# EasyEDA Pro project 科协启蒙1.eprj

# Schematic Schematic1
Board Name: Board1; Create Date: 2025-02-17; Page Name: P1; Project Name: 科协启蒙1; Schematic Name: Schematic1; Update Date: 2025-02-18; Company: 嘉立创EDA; Page Size: A4; Version: V1.0
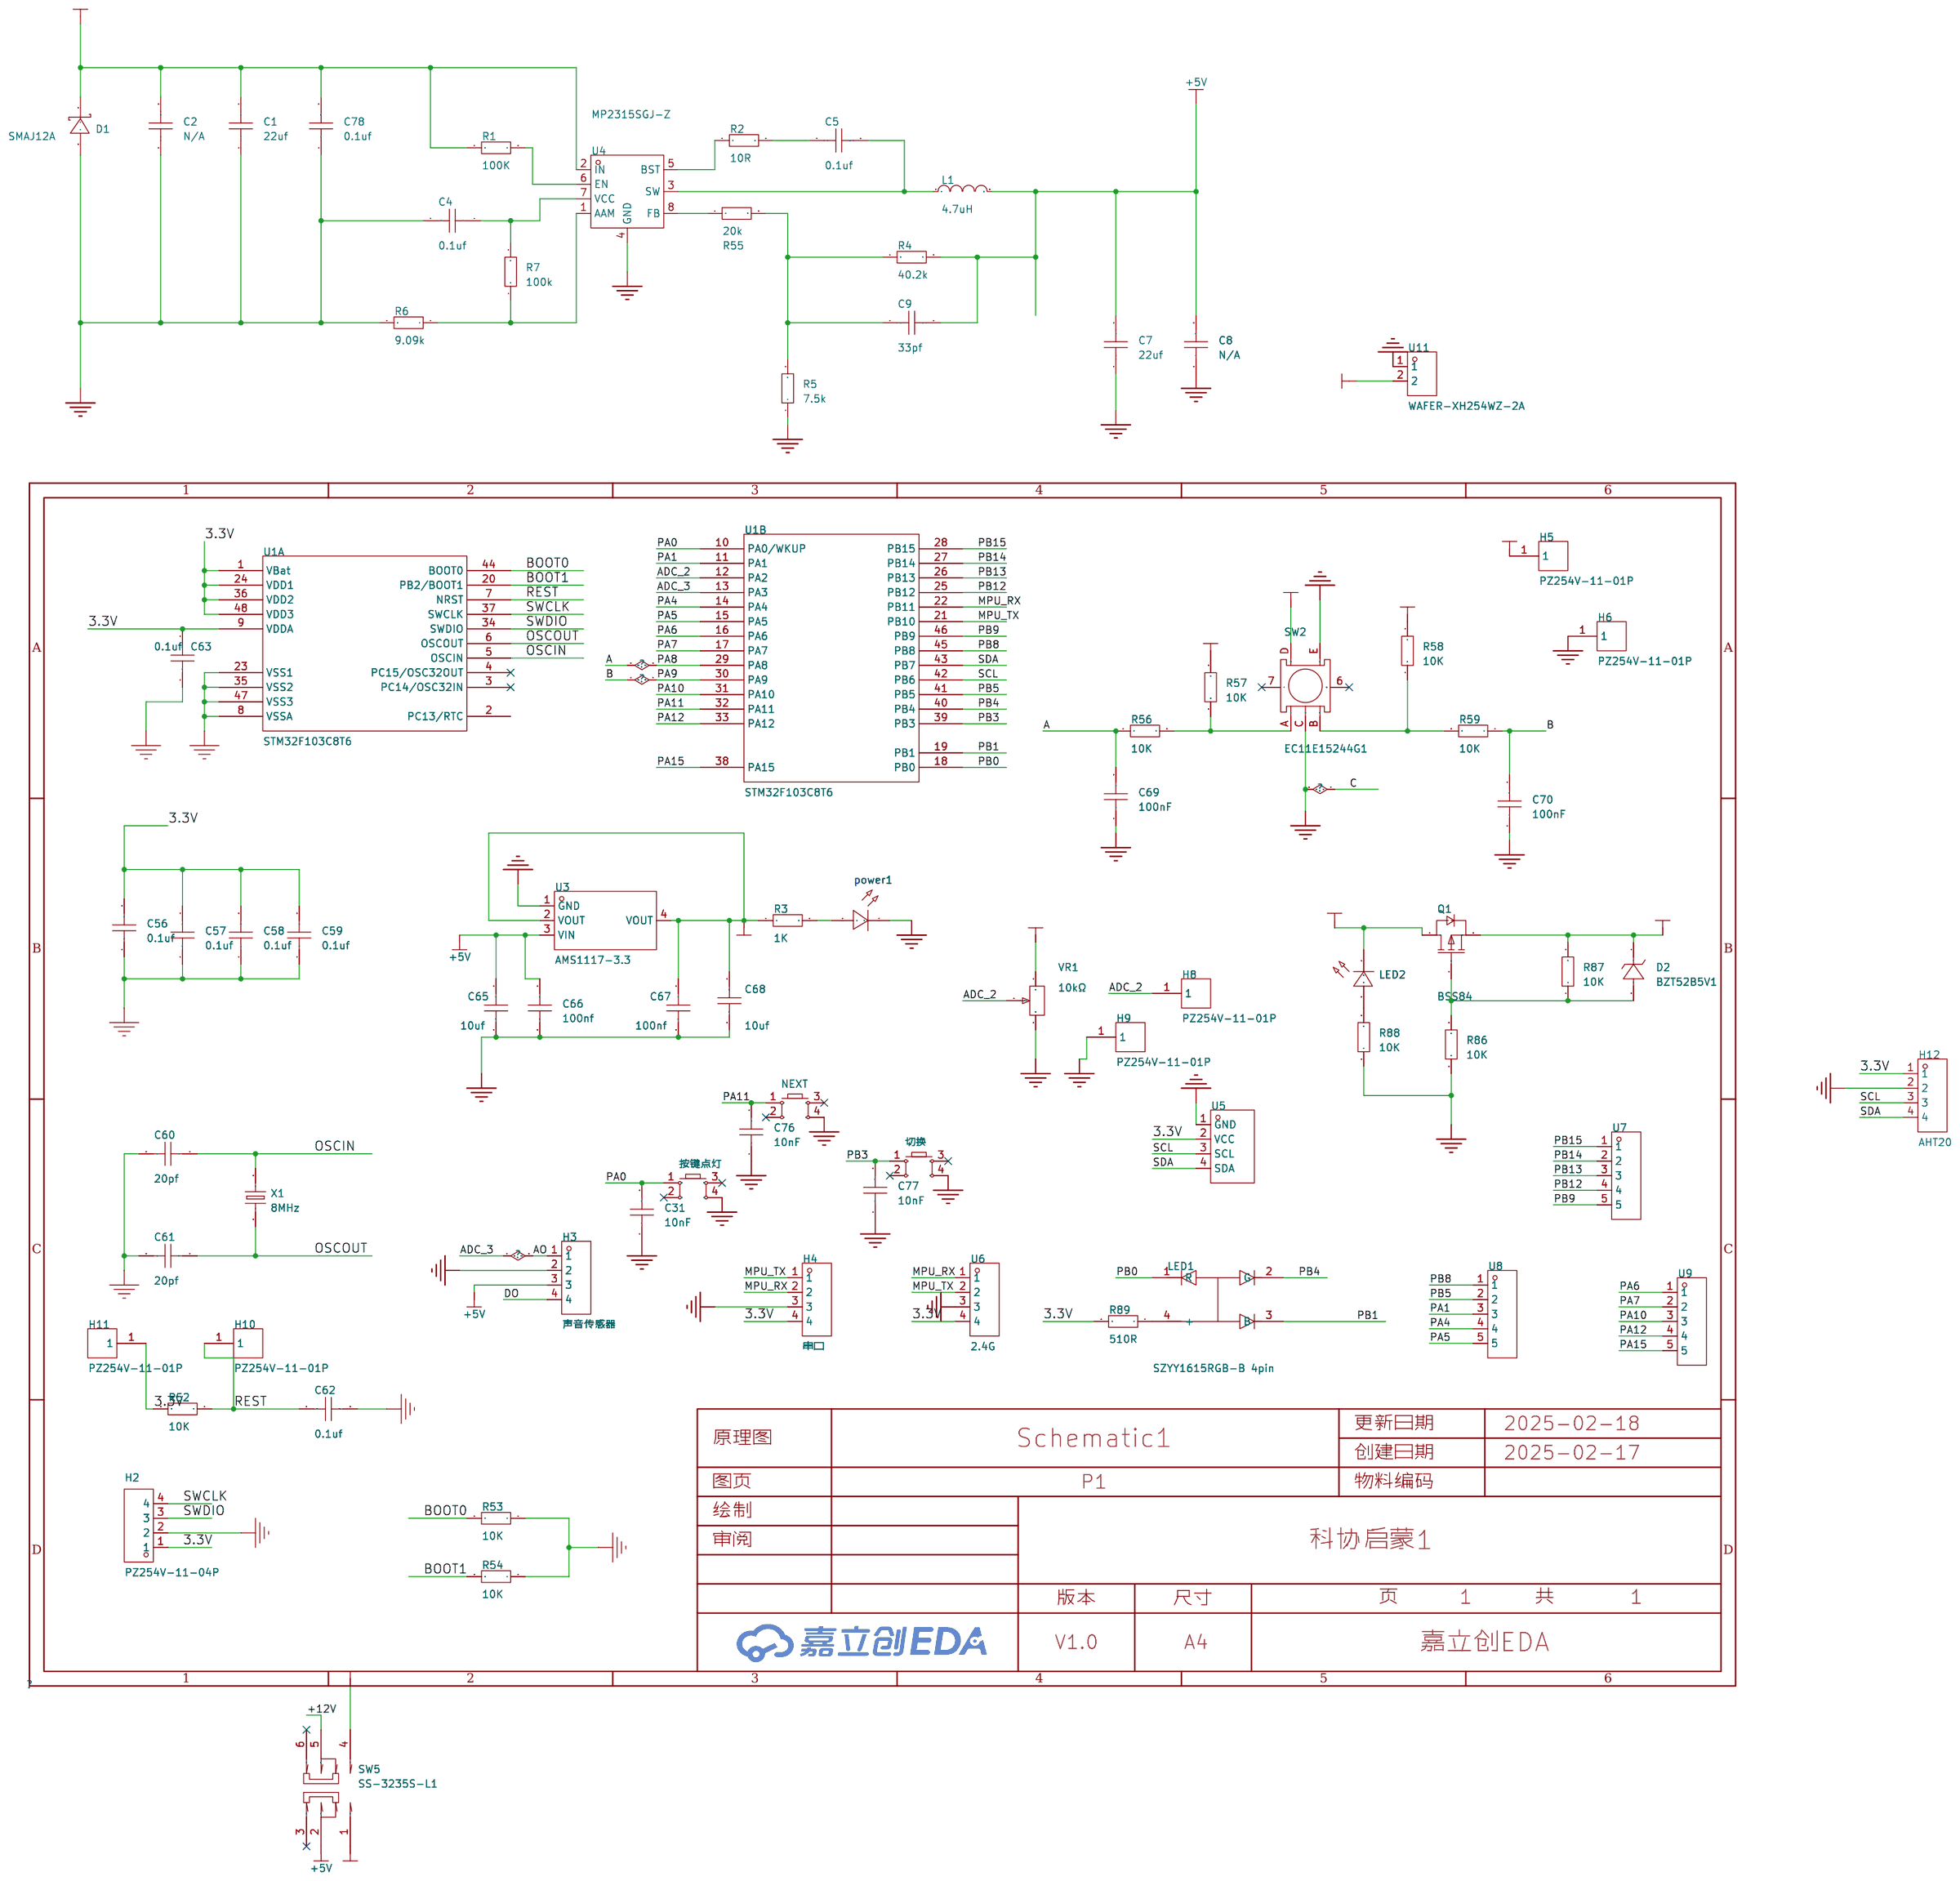
[diagram p0: schematic sheet]

## Parts
C1  22uf  [C1206]
C2  N/A  [C1206]
C4  0.1uf  [C0603]
C5  0.1uf  [C0603]
C7  22uf  [C0805]
C8  N/A  [C0805]
C9  33pf  [C0603]
C31  10nF  [C0603]
C56  0.1uf  [C0603]
C57  0.1uf  [C0603]
C58  0.1uf  [C0603]
C59  0.1uf  [C0603]
C60  20pf  [C0603]
C61  20pf  [C0603]
C62  0.1uf  [C0603]
C63  0.1uf  [C0603]
C65  10uf  [C0603]
C66  100nf  [C0603]
C67  100nf  [C0603]
C68  10uf  [C0603]
C69  100nF  [C0603]
C70  100nF  [C0603]
C76  10nF  [C0603]
C77  10nF  [C0603]
C78  0.1uf  [C0603]
D1  SMAJ12A  [SMA_L4.3-W2.8-LS5.1-RD]
D2  BZT52B5V1  [SOD-123_L2.7-W1.6-LS3.7-RD]
H2  PZ254V-11-04P  [HDR-TH_4P-P2.54-V-M]
H3  声音传感器  [HDR-TH_4P-P2.54-V-M]
H4  串口  [HDR-TH_4P-P2.54-V-M]
H5  PZ254V-11-01P  [HDR-TH_1P-P2.54-V-M]
H6  PZ254V-11-01P  [HDR-TH_1P-P2.54-V-M]
H8  PZ254V-11-01P  [HDR-TH_1P-P2.54-V-M]
H9  PZ254V-11-01P  [HDR-TH_1P-P2.54-V-M]
H10  PZ254V-11-01P  [HDR-TH_1P-P2.54-V-M]
H11  PZ254V-11-01P  [HDR-TH_1P-P2.54-V-M]
H12  AHT20  [HDR-TH_4P-P2.54-V-M]
L1  4.7uH  [IND-SMD_L7.8-W7.0_MAPM0630F]
LED1  SZYY1615RGB-B 4pin  [LED-SMD_4P-L1.6-W1.5-TR-1]
LED2  -  [LED_0805]
NEXT  -  [SW-SMD_4P-L6.0-W6.0-P4.50-LS9.0-2]
power1  -  [LED_0805]
Q1  BSS84  [SOT-23-3_L2.9-W1.3-P1.90-LS2.4-BR-1]
R1  100K  [R0805]
R2  10R  [R0805]
R3  1K  [R0805]
R4  40.2k  [R0805]
R5  7.5k  [R0805]
R6  9.09k  [R0805]
R7  100k  [R0805]
R52  10K  [R0805]
R53  10K  [R0805]
R54  10K  [R0805]
R55  20k  [R0805]
R56  10K  [R0805]
R57  10K  [R0805]
R58  10K  [R0805]
R59  10K  [R0805]
R86  10K  [R0805]
R87  10K  [R0805]
R88  10K  [R0805]
R89  510R  [R0805]
SW2  EC11E15244G1  [SW-TH_EC11E15244G1]
SW5  SS-3235S-L1  [SW-SMD_SS-3235S-LX]
U1  STM32F103C8T6  [LQFP48]  (sections 1,2)
U3  AMS1117-3.3  [SOT-223-3_L6.5-W3.4-P2.30-LS7.0-BR]
U4  MP2315SGJ-Z  [TSOT-23-8_L2.9-W1.6-P0.65-LS2.8-BL]
U5  HS96L03W2C03  [OLED-TH_L27.8-W27.2-P2.54_C9900033791]
U6  2.4G  [HDR-TH_4P-P2.00-V-M]
U7  MH254V-11-05-1196  [HDR-TH_5P-P2.54-V-M-1]
U8  MH254V-11-05-1196  [HDR-TH_5P-P2.54-V-M-1]
U9  MH254V-11-05-1196  [HDR-TH_5P-P2.54-V-M-1]
U11  WAFER-XH254WZ-2A  [CONN-TH_2P-P2.50_WAFER-XH254WZ-2A]
VR1  10kΩ  [RES-ADJ-TH_3362P]
X1  8MHz  [HC-49US_L11.5-W4.5-P4.88]
切换  -  [SW-SMD_4P-L6.0-W6.0-P4.50-LS9.0-2]
按键点灯  -  [SW-SMD_4P-L6.0-W6.0-P4.50-LS9.0-2]

## Library data of the parts
C1 C2 = CAP_1206: Supplier Footprint: 1206
C4 C5 C9 C31 C56-C63 C65-C70 C76-C78 = CAP_0603: Supplier Footprint: 0603
C7 C8 = CAP_0805: Supplier Footprint: 0805
D1 = SMAJ12A: 反向截止电压(Vrwm):12V;最大钳位电压:19.9V;峰值脉冲电流(Ipp)@10/1000us:20.1A;击穿电压:13.3V;; LCSC Part Name: 单向TVS 12V截止 20.1A峰值脉冲; Supplier Part: C356741; Manufacturer: JJW(捷捷微); Supplier Footprint: SMA(DO-214AC); JLCPCB Part Class: 扩展库; Datasheet: https://atta.szlcsc.com/upload/public/pdf/source/20190118/C364660_B64EB57815AD6306F3CC88F8ECD7A3CF.pdf; Supplier: LCSC; Reverse Stand-Off Voltage (Vrwm): 12V; Maximum Clamping Voltage: 19.9V; Peak Pulse Current (Ipp)@10/1000us: 20.1A; Breakdown Voltage: 13.3V; Type: TVS
D2 = BZT52B5V1_C19077393: Supplier Part: C19077393; Manufacturer: 宏嘉诚; Supplier Footprint: SOD-123; JLCPCB Part Class: 扩展库; Datasheet: https://atta.szlcsc.com/upload/public/pdf/source/20250106/AFD01FE5B0C707EDCEE558C585303F64.pdf; Supplier: LCSC; Diode Configuration: 独立式; Zener Voltage(Nom): 5.1V; Reverse Leakage Current (Ir): 2uA@2V; Zener Voltage(Range): 5V~5.2V; Pd - Power Dissipation(Pd): 500mW; Impedance(Zzt): 60Ω
H2-H4 H12 = PZ254V-11-04P: 插针结构:1x4P;间距:2.54mm;行距:-;圆针/方针:方针;安装类型:直插;排数:单排;总PIN位数:4P;额定电流:3A;额定电压:250V;配合针长度:6mm;塑高:2.5mm;端接针长度:3mm;触头材质:-;工作温度范围:-40℃~+105℃;颜色:黑色;; LCSC Part Name: 间距:2.54mm 1x4P 直插 方针; Supplier Part: C2691448; Manufacturer: XFCN(兴飞); Supplier Footprint: 插件,P=2.54mm; JLCPCB Part Class: 扩展库; Datasheet: https://atta.szlcsc.com/upload/public/pdf/source/20200309/C492403_F9F19131791D08044AD4F84F8E751A34.pdf; Supplier: LCSC; Pin Structure: 1x4P; Pitch: 2.54mm; Circluar Pins/Square Pins: 方针; Mounting Type: 直插; Number of Rows: 单排; Number of Pins: 4P; Current Rating (Max): 3A; Voltage Rating (Max): 250V; Length of Mating Pin: 6mm; Insulation Height: 2.5mm; Length of End Connection Pin: 3mm; Operating Temperature Range: -40℃~+105℃; Color: 黑色
H5 H6 H8-H11 = PZ254V-11-01P: LCSC Part Name: 间距:2.54mm 1x1P 直插 方针; Supplier Part: C492400; Manufacturer: XFCN(兴飞); Supplier Footprint: 插件,P=2.54mm; Datasheet: https://atta.szlcsc.com/upload/public/pdf/source/20200309/C492400_46876A5B545F5AE6B8D4A09C46E276E8.pdf; Supplier: LCSC; Pin Structure: 1x1P; Pitch: 2.54mm; Circluar Pins/Square Pins: 方针; Mounting Type: 直插; Number of Rows: 单排; Number of Pins: 1P; Length of Mating Pin: 6mm; Insulation Height: 2.5mm; Length of End Connection Pin: 3mm; Contact Material: 黄铜; Operating Temperature Range: -40℃~+105℃; Color: 黑色
L1 = JSHC0630H-4R7M-G: 电感值:4.7uH;精度:±20%;额定电流:5.5A;饱和电流(Isat):9A;; LCSC Part Name: 4.7uH ±20% 9A; Supplier Part: C334081; Manufacturer: JINLAI(金籁科技); Supplier Footprint: SMD,7.8x7mm; JLCPCB Part Class: 扩展库; Datasheet: https://atta.szlcsc.com/upload/public/pdf/source/20181121/C334111_5F82636A40C96DA87C2CFACA84BF944B.pdf; Supplier: LCSC; Tolerance: ±20%; Rated Current: 5.5A; Saturation Current (Isat): 9A; DC Resistance (DCR): 38mΩ
LED1 = SZYY1615RGB-B 4pin: Supplier Part: C3029071; Manufacturer: yongyu(永裕光电); Supplier Footprint: SMD-4P,1.6x1.5mm; JLCPCB Part Class: 扩展库; Datasheet: https://atta.szlcsc.com/upload/public/pdf/source/20220608/45D83B315EB4960EAA113BCE10CF8FC7.pdf; Supplier: LCSC
LED2 power1 = LED_0805-G: Supplier Footprint: 0805
NEXT 切换 按键点灯 = Key_SMD_6x6x6.5: Supplier Footprint: SMD
Q1 = BSS84_C7420340: LCSC Part Name: P沟道,电流:-0.17A,耐压:-60V; Supplier Part: C7420340; Manufacturer: 宏迦橙; Supplier Footprint: SOT-23; JLCPCB Part Class: 扩展库; Datasheet: https://atta.szlcsc.com/upload/public/pdf/source/20230630/CFCF3EFF80655E4500DCC7BD4B2736C9.pdf; Supplier: LCSC; Type: 1个P沟道; Drain Source Voltage (Vdss): 60V; Continuous Drain Current (Id): 170mA; Drain Source On Resistance (RDS(on)@Vgs,Id): 8Ω@10V,0.17A; Power Dissipation (Pd): 225mW; Gate Threshold Voltage (Vgs(th)@Id): 900mV@250uA; Total Gate Charge (Qg@Vgs): 1.77nC@10V; Input Capacitance (Ciss@Vds): 43pF; Reverse Transfer Capacitance (Crss@Vds): 2.8pF; Operating Temperature: -55℃~+150℃
R1 R2 R4-R7 R52-R59 R86-R89 = Res_0805: Supplier Footprint: 0805
R3 = 0805W8F1002T5E_C17414: 电阻类型:厚膜电阻;阻值:10kΩ;精度:±1%;功率:125mW;最大工作电压:150V;温度系数:±100ppm/℃;; LCSC Part Name: 10kΩ ±1% 125mW 厚膜电阻; Supplier Part: C17414; Manufacturer: UNI-ROYAL(厚声); Manufacturer Part: 0805W8F1002T5E; Supplier Footprint: 0805; JLCPCB Part Class: 基础库; Datasheet: https://atta.szlcsc.com/upload/public/pdf/source/20200306/C422600_1E6D84923E4A46A82E41ADD87F860B5C.pdf; Supplier: LCSC; Type: 厚膜电阻; Tolerance: ±1%; Power(Watts): 125mW; Overload Voltage (Max): 150V; Temperature Coefficient: ±100ppm/℃; Operating Temperature Range: -55℃~+155℃
SW2 = EC11E15244G1: LCSC Part Name: 编码器; Supplier Part: C370970; Manufacturer: ALPSALPINE(阿尔卑斯阿尔派); Supplier Footprint: 插件; JLCPCB Part Class: 扩展库; Datasheet: https://atta.szlcsc.com/upload/public/pdf/source/20190222/C370970_45D3DFC793E5CF6FACAF06DB9E7FAE9E.pdf; Supplier: LCSC
SW5 = SS-3235S-L1: 电路结构:双刀双掷;安装方式:卧贴;开关颜色:黑色;额定电流(DC):50mA;额定电压(DC):12V;额定电流(AC):50mA;额定电压(AC):12V;机械寿命:1万次;; LCSC Part Name: 柄长2mm 卧贴双档 滑动开关; Supplier Part: C500055; Manufacturer: XKB Connectivity(中国星坤); Supplier Footprint: SMD; JLCPCB Part Class: 扩展库; Datasheet: https://atta.szlcsc.com/upload/public/pdf/source/20211011/39D516E750C13BE9339464E723D9F132.pdf; Supplier: LCSC; Circuit: 双刀双掷; Actuator Style: 矩形柱状; Pin Style: 鸥翼型; Switch Length: 9.1mm; Switch Width: 3.55mm; Switch Height: 3.2mm; Mounting Style: 卧贴; Actuator Color: 黑色; Current Rating (DC): 50mA; Voltage Rating (DC): 12V; Current Rating (AC): 50mA; Voltage Rating (AC): 12V; Mechanical Life: 1万次; Operating Temperature: -40℃~+85℃
U1 = STM32F103C8T6: 物料名称: 单片机; 制造商: ST; 物料编码: TIC0036; 单位: PCS; Library Name: Yang_Lib
U3 = AMS1117-3.3_C6186: 输出类型:固定;最大输入电压:-;输出电压:3.3V;最大输出电流:1A;电源纹波抑制比(PSRR):72dB@(120Hz);输出极性:正极;; LCSC Part Name: 输出3.3V 1A; Supplier Part: C6186; Manufacturer: AMS; Supplier Footprint: SOT-223; JLCPCB Part Class: 基础库; Datasheet: https://atta.szlcsc.com/upload/public/pdf/source/20180727/C6186_7A095716F0823C02F1997A905E26C086.pdf; Supplier: LCSC; Output Type: 固定; Output Voltage: 3.3V; MAX Output Current: 1A; Power Supply Rejection Ratio (PSRR): 72dB@(120Hz); Dropout Voltage: 1.3V@(800mA); Output Polarity: 正极; Number of Outputs: 1
U4 = MP2315SGJ-Z: 功能类型:降压型;输出类型:可调;输入电压:4.5V~24V;输出电压:800mV~22.8V;输出电流:3A;; LCSC Part Name: 3A、24V、500kHz高效同步降压转换器; Supplier Part: C3031493; Manufacturer: MPS(芯源); Supplier Footprint: TSOT-23-8; JLCPCB Part Class: 扩展库; Supplier: LCSC; Function: 降压型; Output Type: 可调; Input Voltage: 4.5V~24V; Output Voltage: 800mV~22.8V; Output Current: 3A; Switching Frequency: 500kHz; Operating Temperature: -40℃~+125℃@(TJ); Synchronous Rectification: 是; Number of Outputs: 1; Topology: 降压式; Switch tube (built-in/external): 内置
U5 = HS96L03W2C03: LCSC Part Name: 0.96寸OLED显示屏窄白光IIC; Supplier Part: C5248080; Manufacturer: HS(汉昇); JLCPCB Part Class: 扩展库; Datasheet: https://atta.szlcsc.com/upload/public/pdf/source/20230627/763D01F79A90007632F098068C7C8AD9.pdf; Supplier: LCSC; Main Control Chip: SSD1315; Interface Type: I2C; Size: 0.96; Pixel Resolution: 128x64; Operating Temperature: -40℃~+70℃
U6 = PZ2.0-1*4: Supplier Part: C5224023; Manufacturer: ZHOURI(洲日); Supplier Footprint: 插件,P=2mm; JLCPCB Part Class: 扩展库; Datasheet: https://atta.szlcsc.com/upload/public/pdf/source/20221031/86DA6B3F99D5190A1F12189D7144ED5B.pdf; Supplier: LCSC; Pin Structure: 1x4P; Pitch: 2mm; Mounting Type: 直插; Number of Rows: 单排; Number of Pins: 4P; Contact Plating: 金
U7-U9 = MH254V-11-05-1196: Supplier Part: C3015084; Manufacturer: XFCN(兴飞); Supplier Footprint: 插件,P=2.54mm; JLCPCB Part Class: 扩展库; Datasheet: https://atta.szlcsc.com/upload/public/pdf/source/20220518/54992A1A2DF1C7E5202B51C2B9A2DABB.pdf; Supplier: LCSC
U11 = WAFER-XH254WZ-2A: Supplier Part: C7432691; Manufacturer: HANBO(汉博); Supplier Footprint: 插件,P=2.5mm; JLCPCB Part Class: 扩展库; Datasheet: https://atta.szlcsc.com/upload/public/pdf/source/20230721/127D646758C1D4B76FEF9901992220E1.pdf; Supplier: LCSC; Pins Structure: 1x2P; Pitch: 2.54mm; Mounting Style: 弯插; Reference Series: XH; Number of Pins: 2P; Number of Rows: 1; Number of PINs Per Row: 2; Current Rating (Max): 3A; Operating Temperature Range: -25℃~+85℃
VR1 = 3362P-1-103LF: LCSC Part Name: 10kΩ ±10%; Supplier Part: C58159; Manufacturer: BOURNS; Supplier Footprint: 插件-3P,7x6.6mm; JLCPCB Part Class: 扩展库; Datasheet: https://atta.szlcsc.com/upload/public/pdf/source/20160823/1471947545189.pdf; Supplier: LCSC; Tolerance: ±10%; Power(Watts): 500mW; Temperature Coefficient: ±100ppm/℃; Turns: 1
X1 = B08000J126: 晶振类型:直插晶振;频率:8MHz;常温频差:±10ppm;外接负载电容:20pF;频率稳定度(全温):±30ppm;; LCSC Part Name: 8MHz ±10ppm 20pF; Supplier Part: C280060; Manufacturer: ECEC(东晶); Supplier Footprint: HC-49S; JLCPCB Part Class: 扩展库; Datasheet: https://atta.szlcsc.com/upload/public/pdf/source/20190117/C280060_C26E861D869AE2E9E449CE809FA26154.pdf; Supplier: LCSC; Crystal Type: 直插晶振; Normal temperature Frequency Tolerance: ±10ppm; External load capacitor: 20pF; Frequency Stability(Full temperature range): ±30ppm; Equivalent Series Resistance (ESR): 40Ω; Operating Temperature: -40℃~+85℃

## Nets
3.3V: C56.2 C57.2 C58.2 C59.2 C63.2 C67.1 C68.1 H2.1 H4.4 H11.1 H12.1 R3.1 R52.2 R57.2 R58.2 R89.2 SW2.D U1.1(VBat) U1.9(VDDA) U1.24(VDD1) U1.36(VDD2) U1.48(VDD3) U3.2(VOUT) U3.4(VOUT) U5.2(VCC) U6.4 VR1.1
3.7V: SW5.1 U11.2
+5V: C7.2 C8.2 C9.2 C65.1 C66.1 H3.3 L1.2 R4.2 SW5.2 U3.3(VIN)
+12V: C1.2 C2.2 C78.2 D1.1(K) R1.1 SW5.5 U4.2(IN)
+12V_IN: D2.1(K) Q1.2(S) R87.2 SW5.4
GND: C1.1 C2.1 C4.2 C7.1 C8.1 C31.1 C56.1 C57.1 C58.1 C59.1 C60.2 C61.2 C62.1 C63.1 C65.2 C66.2 C67.2 C68.2 C69.1 C70.1 C76.1 C77.1 C78.1 D1.2(A) H2.2 H3.2 H4.3 H6.1 H9.1 H12.2 NEXT.4 power1.1(C) R5.1 R6.2 R53.1 R54.1 R86.1 R88.1 SW2.C SW2.E U1.8(VSSA) U1.23(VSS1) U1.35(VSS2) U1.47(VSS3) U3.1(GND) U4.4(GND) U5.1(GND) U6.3 U11.1 VR1.3 切换.4 按键点灯.4
A: C69.2 R56.1 U1.29(PA8)
ADC_2: H8.1 U1.12(PA2) VR1.2
ADC_3: H3.1 U1.13(PA3)
B: C70.2 R59.1 U1.30(PA9)
BAT+: H5.1 LED2.1(C) Q1.3(D)
BOOT0: R53.2 U1.44(BOOT0)
BOOT1: R54.2 U1.20(PB2/BOOT1)
DO: H3.4
MPU_RX: H4.2 U1.22(PB11) U6.1
MPU_TX: H4.1 U1.21(PB10) U6.2
OSCIN: C60.1 U1.5(OSCIN) X1.2
OSCOUT: C61.1 U1.6(OSCOUT) X1.1
PA0: C31.2 U1.10(PA0/WKUP) 按键点灯.1
PA1: U1.11(PA1) U8.3
PA4: U1.14(PA4) U8.4
PA5: U1.15(PA5) U8.5
PA6: U1.16(PA6) U9.1
PA7: U1.17(PA7) U9.2
PA10: U1.31(PA10) U9.3
PA11: C76.2 NEXT.1 U1.32(PA11)
PA12: U1.33(PA12) U9.4
PA15: U1.38(PA15) U9.5
PB0: LED1.1(R) U1.18(PB0)
PB1: LED1.3(B) U1.19(PB1)
PB3: C77.2 U1.39(PB3) 切换.1
PB4: LED1.2(G) U1.40(PB4)
PB5: U1.41(PB5) U8.2
PB8: U1.45(PB8) U8.1
PB9: U1.46(PB9) U7.5
PB12: U1.25(PB12) U7.4
PB13: U1.26(PB13) U7.3
PB14: U1.27(PB14) U7.2
PB15: U1.28(PB15) U7.1
REST: C62.2 H10.1 R52.1 U1.7(NRST)
SCL: H12.3 U1.42(PB6) U5.3(SCL)
SDA: H12.4 U1.43(PB7) U5.4(SDA)
SWCLK: H2.4 U1.37(SWCLK)
SWDIO: H2.3 U1.34(SWDIO)
$1N1144: power1.2(A) R3.2
$1N1772: R1.2 U4.6(EN)
$1N1773: C4.1 R7.2 U4.7(VCC)
$1N1775: C5.2 L1.1 U4.3(SW)
$1N1780: R2.1 U4.5(BST)
$1N1781: C5.1 R2.2
$1N1782: C9.1 R4.1 R5.2 R55.2
$1N1784: R55.1 U4.8(FB)
$1N1785: R6.1 R7.1 U4.1(AAM)
$1N2138: R56.2 R57.1 SW2.A
$1N2151: R58.1 R59.2 SW2.B
$1N4333: D2.2(A) Q1.1(G) R86.2 R87.1
$1N4541: LED2.2(A) R88.2
$1N6848: LED1.4(+) R89.1

Not connected (* = marked no-connect by the designer): NEXT 2* 3*; SW2 6* 7*; SW5 3* 6*; U1 2(PC13/RTC) 3(PC14/OSC32IN)* 4(PC15/OSC32OUT)*; 切换 2* 3*; 按键点灯 2* 3*

# Board PCB1
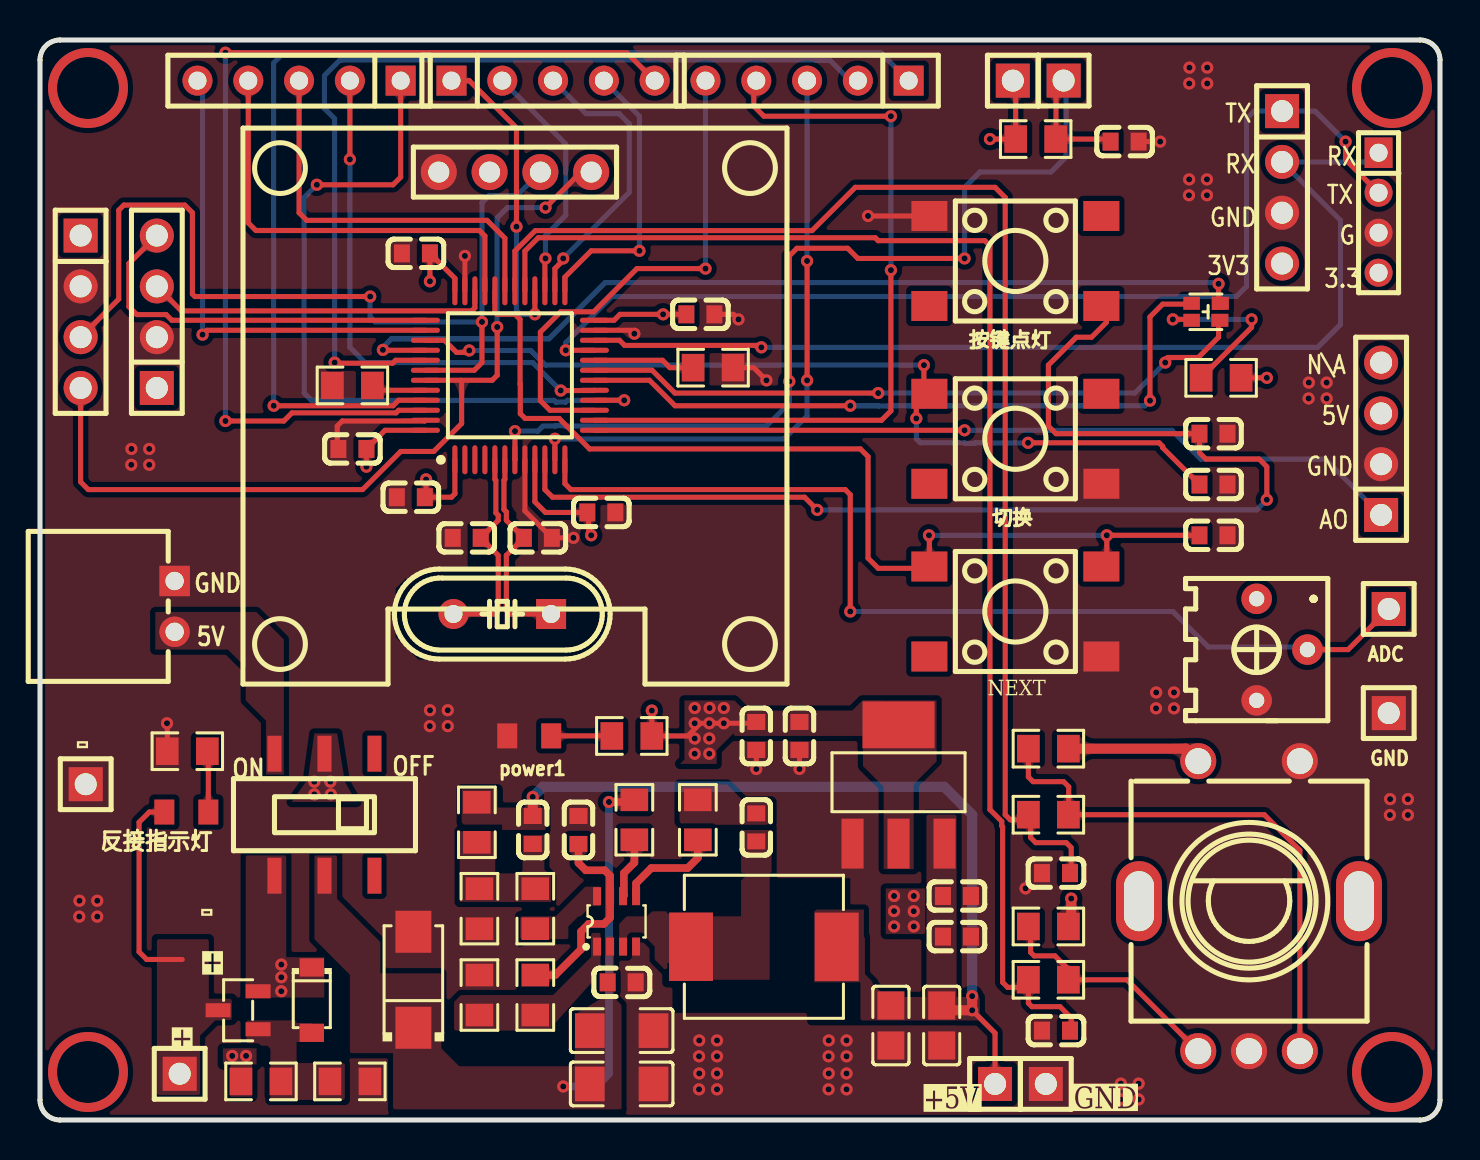
[diagram p1: board, top side]
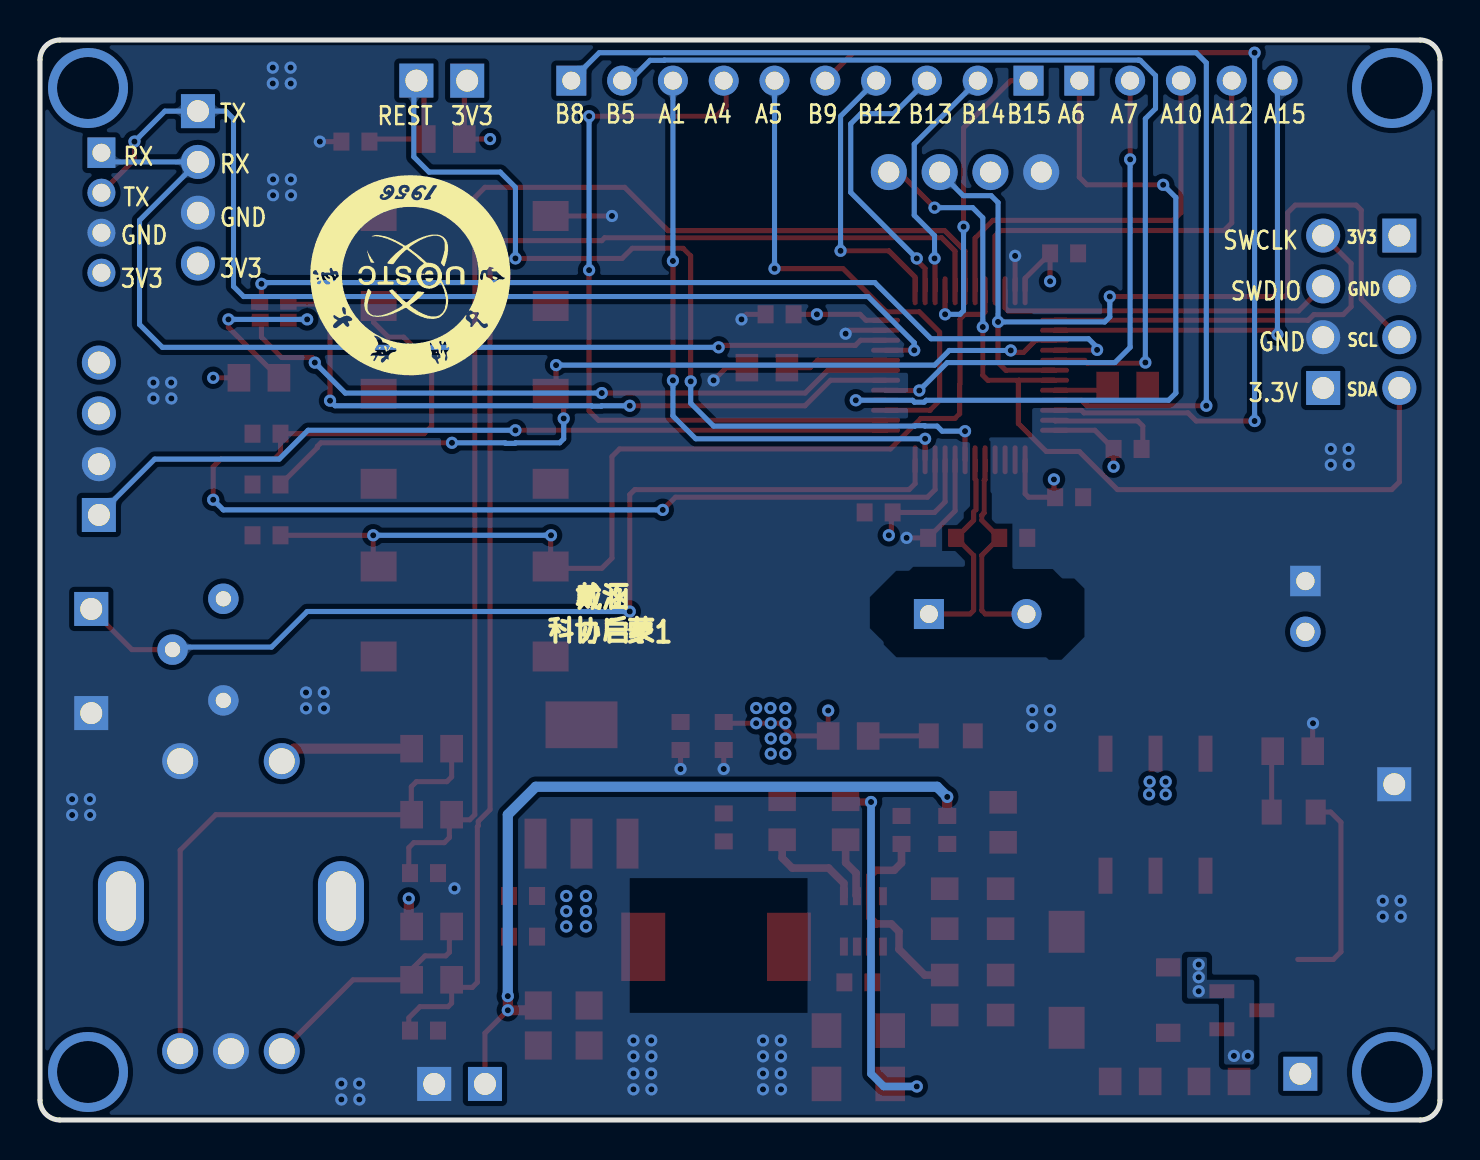
[diagram p2: board, bottom side, seen from below]

Outline 70 x 54 mm; copper layers: Top Layer, Inner1, Inner2, Bottom Layer. Coordinates in mm from the lower left corner of the outline.
Outline path: 0,53 0,1 arc(0.29,0.29) 1,0 69,0 arc(69.71,0.29) 70,1 70,53 arc(69.71,53.71) 69,54 1,54 arc(0.29,53.71) 0,53
Stack: Top Layer 0.035mm 外层铜厚1oz / Dielectric1 0.2104mm 7628 RC49% 8.6mil / Inner1 0.0152mm 内层铜厚 / Dielectric2 1.065mm 1.1mm H/HOZ Copper / Inner2 0.0152mm 内层铜厚 / Dielectric3 0.2104mm 7628 RC49% 8.6mil / Bottom Layer 0.035mm 外层铜厚1oz

## Design rules (mm)
net OSCIN: DP1
net OSCOUT: DP1
template: 自定义配置
spacing copperThickness1oz (default): track to track 0.102, other pairs 0.152 to 0.3
spacing copperThickness2oz: track to track 0.203, other pairs 0.152 to 0.3
track width copperThickness1oz (default): min 0.127, default 0.254, max 2.54
track width copperThickness2oz: min 0.203, default 0.254, max 2.54
differential pair differentialPair (default): width min 0.127, default 0.254, max 2.54; gap min 0.152, default 0.152
via viaSize (default): diameter min 0.5, default 0.61, max 10; hole min 0.3, default 0.305, max 6.3
net +12V uses copperRegion1
net GND uses copperRegion1
net $1N1775 uses copperRegion1
net $1N1781 uses copperRegion1
net +5V uses copperRegion1
net 3.3V uses copperRegion1
net $1N1785 uses copperRegion1
net $1N1784 uses copperRegion1
net $1N4333 uses copperRegion1
net +12V_IN uses copperRegion1
net BAT+ uses copperRegion1

## Placement (name value [footprint] x y rotation side)
ADC  PZ254V-11-01P  [HDR-TH_1P-P2.54-V-M]  67.44 25.55 0 top
C1  22uf  [C1206]  29.08 4.47 180 top
C2  N/A  [C1206]  29.08 1.8 180 top
C4  0.1uf  [C0603]  26.92 14.5 90 top
C5  0.1uf  [C0603]  35.81 14.63 270 top
C7  22uf  [C0805]  45.09 4.72 90 top
C8  N/A  [C0805]  42.54 4.72 90 top
C9  33pf  [C0603]  24.64 14.5 90 top
C31  10nF  [C0603]  58.67 34.31 180 top
C56  0.1uf  [C0603]  33.02 40.28 180 top
C57  0.1uf  [C0603]  18.8 43.33 0 top
C58  0.1uf  [C0603]  18.54 31.14 0 top
C59  0.1uf  [C0603]  28.07 30.38 180 top
C60  20pf  [C0603]  21.34 29.11 180 top
C61  20pf  [C0603]  24.89 29.11 0 top
C62  0.1uf  [C0603]  54.23 48.92 180 top
C63  0.1uf  [C0603]  15.62 33.55 0 top
C65  10uf  [C0603]  45.85 9.17 0 top
C66  100nf  [C0603]  45.85 11.2 0 top
C67  100nf  [C0603]  37.97 19.2 270 top
C68  10uf  [C0603]  35.81 19.2 270 top
C69  100nF  [C0603]  50.8 4.47 0 top
C70  100nF  [C0603]  50.8 12.34 0 top
C76  10nF  [C0603]  58.67 29.23 180 top
C77  10nF  [C0603]  58.67 31.78 180 top
C78  0.1uf  [C0603]  29.08 6.88 180 top
D1  SMAJ12A  [SMA_L4.3-W2.8-LS5.1-RD]  18.67 7.01 90 top
D2  BZT52B5V1  [SOD-123_L2.7-W1.6-LS3.7-RD]  13.59 5.99 270 top
GND  PZ254V-11-01P  [HDR-TH_1P-P2.54-V-M]  67.44 20.34 0 top
H2  PZ254V-11-04P  [HDR-TH_4P-P2.54-V-M]  5.84 40.41 90 top
H3  声音传感器  [HDR-TH_4P-P2.54-V-M]  67.06 34.06 90 top
H4  串口  [HDR-TH_4P-P2.54-V-M]  62.1 46.63 270 top
H5  PZ254V-11-01P  [HDR-TH_1P-P2.54-V-M]  6.98 2.31 0 top
H6  PZ254V-11-01P  [HDR-TH_1P-P2.54-V-M]  2.29 16.79 0 top
H6#2  -  [HDR-TH_1P-P2.54-V-M]  47.75 1.8 0 top
H6#3  -  [HDR-TH_1P-P2.54-V-M]  50.29 1.8 0 top
H10  PZ254V-11-01P  [HDR-TH_1P-P2.54-V-M]  51.18 51.97 0 top
H11  PZ254V-11-01P  [HDR-TH_1P-P2.54-V-M]  48.64 51.97 0 top
H12  AHT20  [HDR-TH_4P-P2.54-V-M]  2.03 40.41 270 top
L1  4.7uH  [IND-SMD_L7.8-W7.0_MAPM0630F]  36.19 8.66 180 top
LED1  SZYY1615RGB-B 4pin  [LED-SMD_4P-L1.6-W1.5-TR-1]  58.29 40.41 90 top
LED2  -  [LED_0805]  7.37 15.39 0 top
NEXT  -  [SW-SMD_4P-L6.0-W6.0-P4.50-LS9.0-2]  48.77 25.42 0 top
power1  -  [LED_0805]  24.51 19.2 0 top
Q1  BSS84  [SOT-23-3_L2.9-W1.3-P1.90-LS2.4-BR-1]  9.91 5.49 0 top
R1  100K  [R0805]  29.72 15.01 270 top
R2  10R  [R0805]  32.89 15.01 90 top
R3  1K  [R0805]  29.59 19.2 180 top
R4  40.2k  [R0805]  21.84 14.88 90 top
R5  7.5k  [R0805]  21.97 10.57 90 top
R6  9.09k  [R0805]  21.97 6.25 90 top
R7  100k  [R0805]  24.76 6.25 90 top
R52  10K  [R0805]  49.78 49.05 180 top
R53  10K  [R0805]  15.62 36.73 0 top
R54  10K  [R0805]  33.66 37.62 180 top
R55  20k  [R0805]  24.76 10.57 90 top
R56  10K  [R0805]  50.42 7.01 0 top
R57  10K  [R0805]  50.42 9.68 0 top
R58  10K  [R0805]  50.42 18.57 0 top
R59  10K  [R0805]  50.42 15.27 0 top
R86  10K  [R0805]  15.49 1.93 180 top
R87  10K  [R0805]  11.05 1.93 180 top
R88  10K  [R0805]  7.37 18.44 0 top
R89  510R  [R0805]  59.06 37.11 0 top
SW2  EC11E15244G1  [SW-TH_EC11E15244G1]  60.45 10.69 0 top
SW5  SS-3235S-L1  [SW-SMD_SS-3235S-LX]  14.22 15.27 0 top
U1  STM32F103C8T6  [LQFP48]  23.5 37.24 90 top
U3  AMS1117-3.3  [SOT-223-3_L6.5-W3.4-P2.30-LS7.0-BR]  42.93 16.79 270 top
U4  MP2315SGJ-Z  [TSOT-23-8_L2.9-W1.6-P0.65-LS2.8-BL]  28.83 9.93 0 top
U5  HS96L03W2C03  [OLED-TH_L27.8-W27.2-P2.54_C9900033791]  23.75 47.4 0 top
U6  2.4G  [HDR-TH_4P-P2.00-V-M]  66.93 45.36 270 top
U7  MH254V-11-05-1196  [HDR-TH_5P-P2.54-V-M-1]  25.65 51.97 0 top
U8  MH254V-11-05-1196  [HDR-TH_5P-P2.54-V-M-1]  38.35 51.97 180 top
U9  MH254V-11-05-1196  [HDR-TH_5P-P2.54-V-M-1]  12.95 51.97 180 top
U11  WAFER-XH254WZ-2A  [CONN-TH_2P-P2.50_WAFER-XH254WZ-2A]  6.73 25.68 270 top
VR1  10kΩ  [RES-ADJ-TH_3362P]  62.1 23.52 270 top
X1  8MHz  [HC-49US_L11.5-W4.5-P4.88]  23.11 25.3 180 top
切换  -  [SW-SMD_4P-L6.0-W6.0-P4.50-LS9.0-2]  48.77 34.06 0 top
按键点灯  -  [SW-SMD_4P-L6.0-W6.0-P4.50-LS9.0-2]  48.77 42.95 180 top

## Footprints (pads in the part's own frame, mm; a bottom-side part is the same pattern mirrored in y, then rotated)
C0603
  rect 0.8x0.9 smd: 1(-0.7,0) 2(0.7,0)
C0805
  rect 1.41x1.35 smd: 1(-1,0) 2(1,0)
C1206
  rect 1.485x1.728 smd: 1(-1.593,0) 2(1.593,0)
CONN-TH_2P-P2.50_WAFER-XH254WZ-2A
  rect 1.524x1.524 hole 0.914: 1(-1.27,0)
  round 1.524 hole 0.914: 2(1.27,0)
HC-49US_L11.5-W4.5-P4.88
  rect 1.5x1.5 hole 0.9: 1(-2.44,0)
  round 1.5 hole 0.9: 2(2.44,0)
HDR-TH_1P-P2.54-V-M
  rect 1.7x1.7 hole 1.1: 1(0,0)
HDR-TH_4P-P2.00-V-M
  rect 1.524x1.4 hole 0.9: 1(-3,0)
  round 1.4 hole 0.9: 2(-1,0) 3(1,0) 4(3,0)
HDR-TH_4P-P2.54-V-M
  rect 1.7x1.7 hole 1.1: 1(-3.81,0)
  round 1.7 hole 1.1: 2(-1.27,0) 3(1.27,0) 4(3.81,0)
HDR-TH_5P-P2.54-V-M-1
  rect 1.5x1.5 hole 0.9: 1(-5.08,0)
  round 1.5 hole 0.9: 2(-2.54,0) 3(0,0) 4(2.54,0) 5(5.08,0)
IND-SMD_L7.8-W7.0_MAPM0630F
  rect 2.194x3.42 smd: 1(3.643,0) 2(-3.643,0)
LED-SMD_4P-L1.6-W1.5-TR-1
  custom 0.65x0.825 smd: 1(0.425,0.713) 4(-0.425,0.713)
  rect 0.65x0.65 smd: 2(0.425,-0.625)
  custom 0.65x0.85 smd: 2(0.425,-0.725)
  custom 0.65x0.851 smd: 3(-0.425,-0.7)
LED_0805
  rect 1x1.25 smd: 1(-1.15,0.005) 2(1.05,0.005)
LQFP48
  oval 1.45x0.254 smd: 1(-4.225,2.75) 2(-4.225,2.25) 3(-4.225,1.75) 4(-4.225,1.25) 5(-4.225,0.75) 6(-4.225,0.25) 7(-4.225,-0.25) 8(-4.225,-0.75) 9(-4.225,-1.25) 10(-4.225,-1.75) 11(-4.225,-2.25) 12(-4.225,-2.75) 25(4.225,-2.75) 26(4.225,-2.25) 27(4.225,-1.75) 28(4.225,-1.25) 29(4.225,-0.75) 30(4.225,-0.25) 31(4.225,0.25) 32(4.225,0.75) 33(4.225,1.25) 34(4.225,1.75) 35(4.225,2.25) 36(4.225,2.75)
  oval 0.254x1.45 smd: 13(-2.75,-4.225) 14(-2.25,-4.225) 15(-1.75,-4.225) 16(-1.25,-4.225) 17(-0.75,-4.225) 18(-0.25,-4.225) 19(0.25,-4.225) 20(0.75,-4.225) 21(1.25,-4.225) 22(1.75,-4.225) 23(2.25,-4.225) 24(2.75,-4.225) 37(2.75,4.225) 38(2.25,4.225) 39(1.75,4.225) 40(1.25,4.225) 41(0.75,4.225) 42(0.25,4.225) 43(-0.25,4.225) 44(-0.75,4.225) 45(-1.25,4.225) 46(-1.75,4.225) 47(-2.25,4.225) 48(-2.75,4.225)
OLED-TH_L27.8-W27.2-P2.54_C9900033791
  round 1.8 hole 1.05: 1(-3.81,0) 2(-1.27,0) 3(1.27,0) 4(3.81,0)
R0805
  rect 1.133x1.377 smd: 1(-1,0) 2(1,0)
RES-ADJ-TH_3362P
  round 1.524 hole 0.762: 1(-2.54,-1.27) 2(0,1.27) 3(2.54,-1.27)
SMA_L4.3-W2.8-LS5.1-RD
  rect 2.1x1.8 smd: 1(-2.4,0) 2(2.4,0)
SOD-123_L2.7-W1.6-LS3.7-RD
  rect 0.91x1.22 smd: 1(-1.635,0) 2(1.635,0)
SOT-23-3_L2.9-W1.3-P1.90-LS2.4-BR-1
  rect 1.25x0.7 smd: 1(1,-0.95) 2(1,0.95) 3(-1,0)
SOT-223-3_L6.5-W3.4-P2.30-LS7.0-BR
  rect 2.5x1.1 smd: 1(2.97,-2.3) 2(2.97,0) 3(2.97,2.3)
  rect 2.34x3.6 smd: 4(-2.97,0)
SW-SMD_4P-L6.0-W6.0-P4.50-LS9.0-2
  rect 1.8x1.5 smd: 1(-4.3,2.25) 2(4.3,2.25) 3(-4.3,-2.25) 4(4.3,-2.25)
SW-SMD_SS-3235S-LX
  rect 0.7x1.8 smd: 1(-2.5,3.05) 2(0,3.05) 3(2.5,3.05) 4(-2.5,-3.05) 5(0,-3.05) 6(2.5,-3.05)
SW-TH_EC11E15244G1
  oval 2.3x4 hole 1.5x3: 6(5.5,0.25) 7(-5.5,0.25)
  round 1.8 hole 1.3: A(-2.54,-7.25) B(2.54,-7.25) C(0,-7.25) D(-2.54,7.25) E(2.54,7.25)
TSOT-23-8_L2.9-W1.6-P0.65-LS2.8-BL
  rect 0.4x0.9 smd: 1(-0.975,-1.26) 2(-0.325,-1.26) 3(0.325,-1.26) 4(0.975,-1.26) 5(0.975,1.26) 6(0.325,1.26) 7(-0.325,1.26) 8(-0.975,1.26)

## Nets
As in the schematic, except:
+5V: C7.2 C8.2 C9.2 C65.1 C66.1 H3.3 H6#2.1 L1.2 R4.2 SW5.2 U3.3
GND: C1.1 C2.1 C4.2 C7.1 C8.1 C31.1 C56.1 C57.1 C58.1 C59.1 C60.2 C61.2 C62.1 C63.1 C65.2 C66.2 C67.2 C68.2 C69.1 C70.1 C76.1 C77.1 C78.1 D1.2 GND.1 H2.2 H3.2 H4.3 H6.1 H6#3.1 H12.2 NEXT.4 power1.1 R5.1 R6.2 R53.1 R54.1 R86.1 R88.1 SW2.C SW2.E U1.8 U1.23 U1.35 U1.47 U3.1 U4.4 U5.1 U6.3 U11.1 VR1.3 切换.4 按键点灯.4
ADC_2: ADC.1 U1.12 VR1.2
PA11: C76.2 NEXT.1 NEXT.2 U1.32

Pads without a net: NEXT 3; SW2 6 7; SW5 3 6; U1 2 3 4; 切换 2 3; 按键点灯 2 3

## Via types
v1: diameter 4, hole 3.1, Top Layer to Bottom Layer, 4 vias
v2: diameter 0.61, hole 0.305, Top Layer to Bottom Layer, 150 vias

## Routing (per net, layer and track width the routed paths; a pad name or vN(x,y) marks a point on that pad's centre or on a via; arc(x,y) is an arc through that point)
3.3V: length 43.6
  Top Layer w0.254: v2(16.32,32.66) C63.2 17.25,34.49 U1.48 ; v2(19.3,32.03) 19.3,31.2 C58.2 20.57,31.14 20.75,31.31 U1.1 ; U1.36 20.75,42.08 C57.2 v2(19.5,41.94) ; v2(30.59,20.47) R3.1 32.38,19.2 33.02,19.84 35.75,19.84 C68.1 ; R89.2 v2(61.34,37.11) ; U1.24 28.7,39.99 29,40.28 v2(31.16,40.28) C56.2 ; U1.9 24.75,30.91 25.27,30.38 C59.2 27.43,30.31 27.43,29.36 v2(27.56,29.23) ; v2(47.5,49.05) R52.2 48.78,51.83 H11.1
  Top Layer w0.508: v2(51.56,11.07) 51.56,9.82 R57.2 ; R58.2 57.29,18.57 SW2.D
  vias: v2(32.74,20.6) v2(32.74,19.84) v2(32.74,19.08) v2(32.74,18.31) v2(33.48,20.6) v2(33.46,19.84) v2(33.46,19.08) v2(33.46,18.31) v2(34.19,20.6) v2(34.19,19.84)
+5V: length 83.4
  Top Layer w0.254: v2(46.61,5.49) 47.75,4.34 H6#2.1
  Top Layer w0.508: C7.2 45.32,5.49 v2(46.61,5.49) v2(46.61,6.19) ; C9.2 v2(24.64,16.15)
  Inner1 w0.762: 43.43,8.66 43.43,24.79 53.21,34.57 66.29,34.57 H3.3
  Bottom Layer w0.508: v2(46.61,6.19) 46.61,15.27 45.21,16.66 25.15,16.66 v2(24.64,16.15)
  vias: v2(13.72,16.92) v2(13.72,16.28) v2(14.52,16.92) v2(14.54,16.28) v2(42.7,11.2) v2(42.7,10.44) v2(42.7,9.68) v2(43.69,11.2) v2(43.69,10.44) v2(43.69,9.68)
+12V: length 17.5
  Top Layer w0.381: R1.1 29.61,15.9 v2(28.45,15.9)
  Bottom Layer w0.381: v2(28.45,15.9) 28.45,2.31 27.81,1.68 v2(26.16,1.68)
+12V_IN:
  vias: v2(9.61,3.21) v2(10.3,3.21) v2(12.06,7.77) v2(12.06,7.14) v2(12.06,6.44)
GND: length 25.5
  Top Layer w0.254: C63.1 14.86,33.61 14.86,34.7 15.11,34.95 19.23,34.95 U1.47 ; C62.1 v2(56.01,48.92) ; R54.1 35.69,37.62 v2(36.32,36.98) ; v2(26.67,29.11) C61.2 24.25,30.45 U1.8 ; C68.2 v2(35.81,17.55) ; v2(29.72,39.31) 29.55,39.49 U1.23 ; C56.1 34.67,40.28 v2(34.93,40.03) ; 44.22,45.2 v2(41.4,45.2) ; v2(6.35,19.84) 6.37,19.82 R88.1 ; C67.2 v2(37.97,17.55) ; U1.35 v2(21.25,43.2)
  vias: v2(1.97,10.96) v2(1.96,10.17) v2(2.86,10.96) v2(2.86,10.17) v2(4.57,33.55) v2(4.56,32.76) v2(5.46,33.55) v2(5.46,32.76) v2(19.5,20.49) v2(19.49,19.69) v2(20.39,20.49) v2(20.39,19.69) v2(32.96,3.98) v2(32.95,3.18) v2(32.96,2.33) v2(32.95,1.53) v2(33.85,3.98) v2(33.85,3.18) v2(33.85,2.33) v2(33.85,1.53) v2(39.44,3.98) v2(39.43,3.18) v2(39.44,2.33) v2(39.43,1.53) v2(40.33,3.98) v2(40.33,3.18) v2(40.33,2.33) v2(40.33,1.53) v2(49.28,11.58) v2(54.04,1.82) v2(54.03,1.03) v2(54.93,1.82) v2(54.93,1.03) v2(55.81,21.38) v2(55.8,20.58) v2(56.7,21.38) v2(56.7,20.58) v2(57.45,46.24) v2(57.47,52.62) v2(57.46,51.83) v2(57.46,47.03) v2(58.35,47.03) v2(58.35,46.24) v2(58.36,52.62) v2(58.36,51.83) v2(63.44,36.87) v2(63.43,36.08) v2(64.33,36.87) v2(64.33,36.08) v2(67.51,16.04) v2(67.5,15.25) v2(68.39,16.04) v2(68.39,15.25)
(no net):
  vias: v1(2.4,51.6) v1(2.4,2.4) v1(67.6,51.6) v1(67.6,2.4)
A: length 68.6
  Top Layer w0.254: U1.29 24.25,43.45 24.91,44.11 41.76,44.11 41.91,43.97 47.24,43.97 47.5,43.71 47.5,15.52 48.09,14.93 48.09,14.71 48.13,14.66 48.13,6.88 48.39,6.63 49.04,6.63 R56.1 49.42,5.84 49.6,5.67 51,5.67 51.56,5.1 51.56,4.53 C69.2
ADC_2: length 50.1
  Top Layer w0.254: v2(40.51,25.42) 40.51,31.27 40.26,31.52 26.54,31.52 26.25,31.82 U1.12 ; 63.37,23.52 65.41,23.52 ADC.1
  Bottom Layer w0.254: 63.37,23.52 63.25,23.65 58.42,23.65 56.64,25.42 v2(40.51,25.42)
ADC_3: length 41.1
  Top Layer w0.254: U1.13 v2(46.23,34.49)
  Bottom Layer w0.254: v2(46.23,34.49) 56.6,34.49 58.04,33.05 64.26,33.05 H3.1
B: length 65
  Top Layer w0.254: C70.2 51.56,12.41 51.56,13.61 51.31,13.87 49.78,13.87 49.53,14.12 49.53,15.15 R59.1 49.16,15.01 48.51,15.01 48.26,15.27 48.26,46.13 47.75,46.63 40.77,46.63 38.6,44.47 24.76,44.47 23.75,43.45 U1.30
BAT+: length 10.3
  Top Layer w0.254: LED2.1 5.47,15.4 4.95,14.88 4.95,8.41 5.33,8.03 7.11,8.03
BOOT0: length 2.7
  Top Layer w0.254: R53.2 16.86,36.49 U1.44
BOOT1: length 5.1
  Top Layer w0.254: U1.20 31.13,37.99 31.5,37.62 R54.2
MPU_RX: length 52.3
  Top Layer w0.254: U1.22 28.97,38.99 29.23,38.73 35.97,38.73 v2(36.07,38.63)
  Bottom Layer w0.254: v2(36.07,38.63) 63.88,38.63 65.02,39.78 65.02,44.98 H4.2 66.47,47.9 U6.1
MPU_TX: length 54.4
  Top Layer w0.254: U1.21 v2(26.29,38.49) ; v2(65.28,48.92) 65.28,48.02 U6.2
  Bottom Layer w0.254: v2(65.28,48.92) 63.75,50.44 H4.1 60.71,50.44 60.32,50.06 60.32,41.68 59.82,41.17 28.59,41.17 26.29,38.87 v2(26.29,38.49)
OSCIN: length 10.6
  Top Layer w0.254: U1.5 22.75,32.03 22.79,31.98 22.79,30.36 22.91,30.24 22.91,29.98 C60.1 22.91,28.23 22.91,25.48 22.73,25.3 X1.2
OSCOUT: length 10.6
  Top Layer w0.254: X1.1 23.5,25.3 23.32,25.48 23.32,28.23 C61.1 23.32,29.98 23.32,30.41 23.2,30.52 23.2,31.98 23.25,32.03 U1.6
PA0: length 59.8
  Top Layer w0.254: U1.10 25.25,31.52 25.63,31.14 38.23,31.14 v2(38.86,30.5) ; v2(61.34,31.01) 61.34,32.66 60.96,33.05 58.29,33.05 57.97,33.36 C31.2 50.8,34.31 50.42,34.7 50.42,37.74 51.82,39.14 52.58,39.14 53.32,39.88 53.32,40.7
  Bottom Layer w0.254: v2(38.86,30.5) 60.83,30.5 v2(61.34,31.01)
PA1: length 30.9
  Top Layer w0.254: U1.11 v2(25.75,34.06) ; v2(38.35,36.98) v2(38.35,42.95)
  Bottom Layer w0.254: v2(25.75,34.06) 37.21,34.06 38.35,35.2 v2(38.35,36.98) ; v2(38.35,42.95) U8.3
PA4: length 38.1
  Top Layer w0.254: U1.14 42.07,34.99 42.54,35.46 v2(42.54,42.49) ; U8.4 35.69,51.84 35.69,50.7 36.19,50.19 v2(42.54,50.19)
  Bottom Layer w0.254: v2(42.54,42.49) v2(42.54,50.19)
PA5: length 25.3
  Top Layer w0.254: v2(33.27,42.57) 29.84,42.57 27.69,40.41 26.03,40.41 25.02,39.39 25.02,35.97 25.5,35.49 U1.15
  Bottom Layer w0.254: v2(33.27,42.57) U8.5
PA6: length 37.6
  Top Layer w0.254: U1.16 v2(29.21,35.99) ; U9.1 18.03,47.14 17.65,46.76 v2(13.84,46.76)
  Bottom Layer w0.254: v2(29.21,35.99) 26.37,35.99 26.28,35.89 25.79,35.89 25.7,35.99 13.57,35.99 13.21,36.35 13.21,46.13 v2(13.84,46.76)
PA7: length 26.5
  Top Layer w0.254: v2(26.03,36.47) 27.71,36.47 U1.17 ; U9.2 v2(15.49,48.03)
  Bottom Layer w0.254: v2(15.49,48.03) 15.49,38.63 16.26,37.87 24.64,37.87 v2(26.03,36.47)
PA10: length 20.1
  Top Layer w0.254: U1.31 23.25,44.09 22.35,44.98 13.33,44.98 12.95,45.36 U9.3
PA11: length 50.7
  Top Layer w0.254: NEXT.1 44.47,29.22 v2(44.45,29.23) ; NEXT.2 53.34,27.95 v2(53.34,29.23) C76.2 ; 44.45,27.91 44.13,27.58 41.91,27.58 41.4,28.09 41.4,33.17 41.02,33.55 27.48,33.55 25.96,35.08 24.26,35.08 24.01,35.32 24.01,36.79 24,36.8 24,40.03 23.75,40.28 22.86,40.28 22.75,40.4 U1.32
  Bottom Layer w0.254: v2(44.45,29.23) v2(53.34,29.23)
PA12: length 22
  Top Layer w0.254: U9.4 10.41,44.86 10.8,44.47 21.97,44.47 22.25,44.2 U1.33
PA15: length 24
  Top Layer w0.254: U1.38 8.35,39.49 v2(8.13,39.27)
  Bottom Layer w0.254: v2(8.13,39.27) 8.13,51.71 U9.5
PB0: length 35.1
  Top Layer w0.254: 57.67,40.84 57.62,40.79 56.13,40.79 55.5,40.16 v2(55.5,35.97) ; U1.18 30.48,36.99 31.75,35.71 v2(40.51,35.71)
  Bottom Layer w0.254: v2(40.51,35.71) 41.92,35.71 41.94,35.69 42.4,35.69 42.42,35.71 55.25,35.71 v2(55.5,35.97)
PB1: length 33.8
  Top Layer w0.254: 58.92,39.99 58.93,39.98 58.93,39.14 57.91,38.12 56.39,38.12 56.26,38 v2(56.26,37.87) ; v2(41.91,36.35) 31.75,36.35 30.61,37.49 U1.19
  Bottom Layer w0.254: v2(56.26,37.87) 54.74,36.35 v2(41.91,36.35)
PB3: length 44.5
  Top Layer w0.254: v2(21.46,38.48) 21.36,38.38 20.83,38.38 20.22,38.99 U1.39 ; v2(43.81,35.08) 43.81,35.91 44.22,36.31 44.2,36.33 v2(44.2,37.74) ; v2(49.4,33.86) 55.95,33.86 56.13,33.68 56.13,33.61 C77.2
  Bottom Layer w0.254: v2(49.4,33.86) 46.75,33.86 46.72,33.83 46.25,33.83 46.23,33.86 44.02,33.86 43.81,34.06 v2(43.81,35.08) ; v2(21.46,38.48) 24.53,38.48 25.27,37.74 v2(44.2,37.74)
PB4: length 46.4
  Top Layer w0.254: U1.40 17.17,38.49 v2(17.14,38.51) ; v2(58.93,41.81) 58.93,40.85 LED1.2
  Bottom Layer w0.254: v2(17.14,38.51) 17.14,38.63 17.57,39.06 25.45,39.06 28.26,41.87 58.86,41.87 v2(58.93,41.81)
PB5: length 46.6
  Top Layer w0.254: U1.41 17.78,37.99 17.63,37.84 14.73,37.84
  Bottom Layer w0.254: v2(14.73,37.87) 14.73,50.06 14.22,50.57 14.22,52.22 14.99,52.98 15.06,52.98 15.07,53 38.78,53 38.79,52.98 39.5,52.98 40.51,51.97 U8.2
PB8: length 57.4
  Top Layer w0.254: v2(11.68,35.71) 17.65,35.71 17.93,35.99 U1.45
  Bottom Layer w0.254: v2(11.68,35.71) 11.68,52.86 12.19,53.36 42.04,53.36 U8.1
PB9: length 50.7
  Top Layer w0.254: U1.46 17.93,35.49 17.8,35.36 12.6,35.36 12.19,34.95 v2(9.27,34.95) ; v2(9.27,53.36) 29.34,53.36 U7.5
  Bottom Layer w0.254: v2(9.27,34.95) v2(9.27,53.36)
PB12: length 14.2
  Top Layer w0.254: U1.25 26.25,42.14 27.56,43.46 v2(29.97,43.46)
  Bottom Layer w0.254: v2(29.97,43.46) 29.97,50.19 U7.4
PB13: length 14.6
  Top Layer w0.254: v2(26.16,43.08) 26.16,42.99 25.75,42.57 U1.26
  Bottom Layer w0.254: v2(26.16,43.08) 29.46,46.38 29.46,49.81 28.96,50.32 27.31,50.32 U7.3
PB14: length 12.3
  Top Layer w0.254: U1.27 25.25,43.05 v2(25.27,43.08)
  Bottom Layer w0.254: U7.2 26.29,48.79 26.29,45.24 25.27,44.22 v2(25.27,43.08)
PB15: length 15.5
  Top Layer w0.254: U1.28 v2(24.75,40.28) ; U7.1 21.46,51.97 23.82,49.61 v2(23.82,44.67)
  Bottom Layer w0.254: v2(23.82,44.67) 23.82,40.46 24,40.28 v2(24.75,40.28)
REST: length 51.3
  Top Layer w0.254: 53.53,48.92 53.4,49.05 R52.1 50.8,49.06 50.8,51.59 H10.1 ; v2(37.47,36.93) 37.47,43.2 37.85,43.59 40.39,43.59 40.89,43.08 v2(46.23,43.08) ; v2(23.75,34.44) 23.75,33.02 U1.7
  Bottom Layer w0.254: v2(37.47,36.93) 37.47,35.84 36.32,34.7 26.26,34.7 26.24,34.72 25.77,34.72 25.75,34.7 25.15,34.7 24.89,34.44 v2(23.75,34.44) ; H10.1 51.31,51.84 51.31,48.16 50.55,47.4 46.99,47.4 46.23,46.63 v2(46.23,43.08)
SCL: length 45.3
  Top Layer w0.254: H12.3 3.94,41.05 3.94,45.49 4.19,45.75 7.24,45.75 7.62,45.36 7.62,41.3 7.75,41.17 v2(16.51,41.17) ; v2(22.1,39.9) 22.1,37.87 21.71,37.49 U1.42
  Bottom Layer w0.254: U5.3 23.84,46.22 22.44,46.22 22.1,45.87 v2(22.1,39.9) 16.76,39.9 16.51,40.16 v2(16.51,41.17)
SDA: length 44.7
  Top Layer w0.254: 21.06,36.99 21.08,36.96 21.08,34.82 19.69,33.43 18.03,33.43 16.13,31.52 2.41,31.52 2.03,31.9 H12.4 ; 21.06,36.99 22.61,36.99 22.86,37.24 v2(22.86,39.65) ; 21.06,36.99 U1.43 ; U5.4 27.05,47.4 v2(25.27,45.62)
  Bottom Layer w0.254: v2(25.27,45.62) 23.37,45.62 22.86,45.11 v2(22.86,39.65)
SWCLK: length 19.2
  Top Layer w0.254: H2.4 4.44,42.82 4.44,40.67 4.84,40.27 6.31,40.27 6.59,39.99 U1.37
SWDIO: length 17.3
  Top Layer w0.254: U1.34 21.75,40.61 21.59,40.46 7.07,40.46 H2.3
$1N1144: length 3
  Top Layer w0.254: R3.2 28.59,19.21 power1.2
$1N1772: length 3.1
  Top Layer w0.381: R1.2 29.72,12.87 29.19,12.34 29.19,11.23 U4.6
$1N1773: length 10.3
  Top Layer w0.381: C4.1 26.92,12.85 27.29,12.49 28.23,12.49 28.5,12.22 U4.7 28.5,10.11 28.19,9.8 27.43,9.8 27.05,9.42 27.05,8.53 25.76,7.25 R7.2
$1N1780: length 5.2
  Top Layer w0.381: R2.1 32.89,13.11 32.38,12.6 30.57,12.6 29.8,11.84 U4.5
$1N2138: length 12.1
  Top Layer w0.254: 57.91,3.44 54.34,7.01 R56.2 51.31,7.12 51.31,7.64 50.75,8.21 49.71,8.21 49.53,8.39 49.53,9.57 R57.1
$1N2151: length 27.4
  Top Layer w0.254: 62.99,3.44 62.99,13.49 61.21,15.27 R59.2 51.44,15.28 51.44,16.66 51.18,16.92 49.66,16.92 49.42,17.15 R58.1
$1N4541: length 3.1
  Top Layer w0.254: R88.2 8.42,18.39 LED2.2
$1N6848: length 8.9
  Top Layer w0.254: v2(56.64,40.03) 57.62,40.03 57.67,39.99 ; v2(60.58,40.03) 60.58,39.63 R89.1
  Bottom Layer w0.254: v2(60.58,40.03) v2(56.64,40.03)

## Copper pours and planes (outline as drawn; the poured copper is in the pictures)
3.3V on Top Layer: 32,20.98 35.41,20.98 35.41,17.81 32,17.81
3.3V on Top Layer: 41.15,20.98 44.83,20.98 44.83,12.55 41.15,12.55
3.3V on Top Layer: 34.72,19.2 42.16,19.2 42.16,20.85 42.29,20.98 41.12,20.98 40.61,20.47 34.8,20.47 34.67,20.34 34.67,19.25
3.3V on Inner1: -1.65,55.27 71.75,55.27 71.75,-1.37 -1.65,-1.37
3.7V on Top Layer: 5.76,25.4 12.19,25.4 12.19,17.27 5.76,17.27
+5V on Top Layer: 38.71,10.52 41.66,10.52 41.66,6.88 38.71,6.88
+5V on Top Layer: 42.29,11.58 44.26,11.58 44.26,9.3 42.29,9.3
+5V on Top Layer: 44.32,15.27 45.83,15.27 45.83,5.49 44.32,5.49
+5V on Top Layer: 21.08,16.53 25.27,16.53 25.27,14.5 21.08,14.5
+5V on Top Layer: 12.59,19.33 15.82,19.33 15.82,15.9 12.59,15.9
+5V on Top Layer: 38.61,9.17 41.25,9.17 41.25,7.21 42.31,6.15 46.99,6.15 46.99,4.98 38.61,4.98
+5V on Inner1: 13.08,17.3 43.09,17.3 45.21,15.85 45.21,8.92 42.19,8.92 40.72,12.72 16.38,12.72 13.21,15.9 13.21,17.17
+12V on Top Layer: 13.72,13.23 14.86,13.23 14.86,11.06 17.02,8.9 17.02,7.33 20.07,7.33 20.07,3.34 15.49,3.34 15.49,7.26 13.72,9.04
+12V on Top Layer: 17.65,4.47 17.65,0.53 29.08,0.53 29.08,5.74 28.7,6.12 28.7,9.17 28.28,9.17 28.28,6.21 26.85,5.33 26.71,2.69 20.96,2.69 19.94,3.71 18.41,3.71
+12V_IN on Top Layer: 9.53,3.58 10.6,3.58 10.6,1.16 9.53,1.16
+12V_IN on Top Layer: 10.29,6.76 10.29,13.23 12.31,13.23 12.31,6.72 12.28,6.76
+12V_IN on Top Layer: 10.27,8.14 14.21,8.14 14.21,6.12 10.27,6.12
+12V_IN on Top Layer: 9.14,3.58 10.83,3.58 10.83,2.77 9.14,2.77
+12V_IN on Bottom Layer: 9.29,2.85 9.29,7.01 11.65,7.01 11.65,8.12 11.68,8.15 12.65,8.15 12.65,6.07 10.85,6.07 10.8,6.12 10.8,2.77 9.36,2.77
GND on Top Layer: 29.34,7.39 30.28,7.39 30.28,6.45 31.47,5.26 31.47,4.72 45.85,4.72 45.85,0.53 29.34,0.53
GND on Top Layer: -3.94,55.02 71.5,55.02 71.5,-3.02 -3.94,-3.02
GND on Bottom Layer: -4.7,56.92 75.31,56.92 75.31,-4.67 -4.7,-4.67
GND on Inner2: -1.65,55.65 72.52,55.65 72.52,-1.75 -1.65,-1.75
BAT+ on Top Layer: 5.84,9.04 8.44,9.04 8.44,6.06 9.59,6.06 9.59,5.01 9.48,4.99 9.18,4.99 9.17,4.98 8.76,4.98 8,4.22 8,1.25 5.93,1.25 5.84,1.17
$1N1775 on Top Layer: 30.86,10.31 33.53,10.31 33.53,7.01 30.86,7.01
$1N1775 on Top Layer: 28.96,8.28 28.96,9.8 29.34,10.19 30.35,10.19 30.61,10.44 33.53,10.44 35.05,11.96 35.05,14.38 35.18,14.5 36.45,14.5 36.58,14.63 36.58,6.88 31.37,6.88 31.37,7.39 30.73,8.03 30.73,8.68 30.28,9.13 29.34,9.13 29.34,8.28
$1N1775 on Top Layer: 30.99,12.85 36.48,12.85 36.48,7.01 30.99,7.01
$1N1781 on Top Layer: 31.98,16.77 34.35,16.77 35.19,15.93 36.55,15.93 36.58,15.9 36.58,14.88 36.45,14.76 32.13,14.76 31.98,14.91
$1N1782 on Top Layer: 20.99,14.44 25.56,14.44 25.56,10.9 20.99,10.9
$1N1784 on Top Layer: 24,10.19 25.78,10.19 27.26,11.67 28.14,11.67 28.14,10.75 28.19,10.69 27.54,10.69 27.03,10.19 26.92,10.19 26.42,9.68 26.42,9.04 24.13,9.04 24,8.92
$1N1785 on Top Layer: 21.05,6.25 25.65,6.25 27.56,8.15 27.56,9.38 28.23,9.38 28.23,7.77 27.69,7.23 27.69,7 25.41,4.47 20.7,4.47 20.7,5.9
$1N4333 on Top Layer: 10.29,4.98 12.83,4.98 12.83,2.85 15.21,2.85 15.24,2.82 15.24,1 11.53,1 11.53,3.56 11.37,3.71 10.33,3.71 10.33,4.81 10.29,4.85

Small or netless copper shapes (teardrops, artwork), in the pictures only: 171 on Top Layer, 67 on Bottom Layer, 7 on Inner1

## Text on the board
Bottom Silkscreen Layer: GND | SCL | 3V3 | SDA | A15 | 3.3V | SWDIO | SWCLK | A12 | A10 | A7 | A6 | B15 | B14 | B13 | B12 | B9 | A5 | A4 | A1 | B5 | B8 | REST | TX | RX | 戴涵 / 科协启蒙1
Top Silkscreen Layer: 3V3 | GND | TX | RX | N\A | AO | 5V | 3.3 | G | ON | OFF | 反接指示灯 | - | + | +5V
